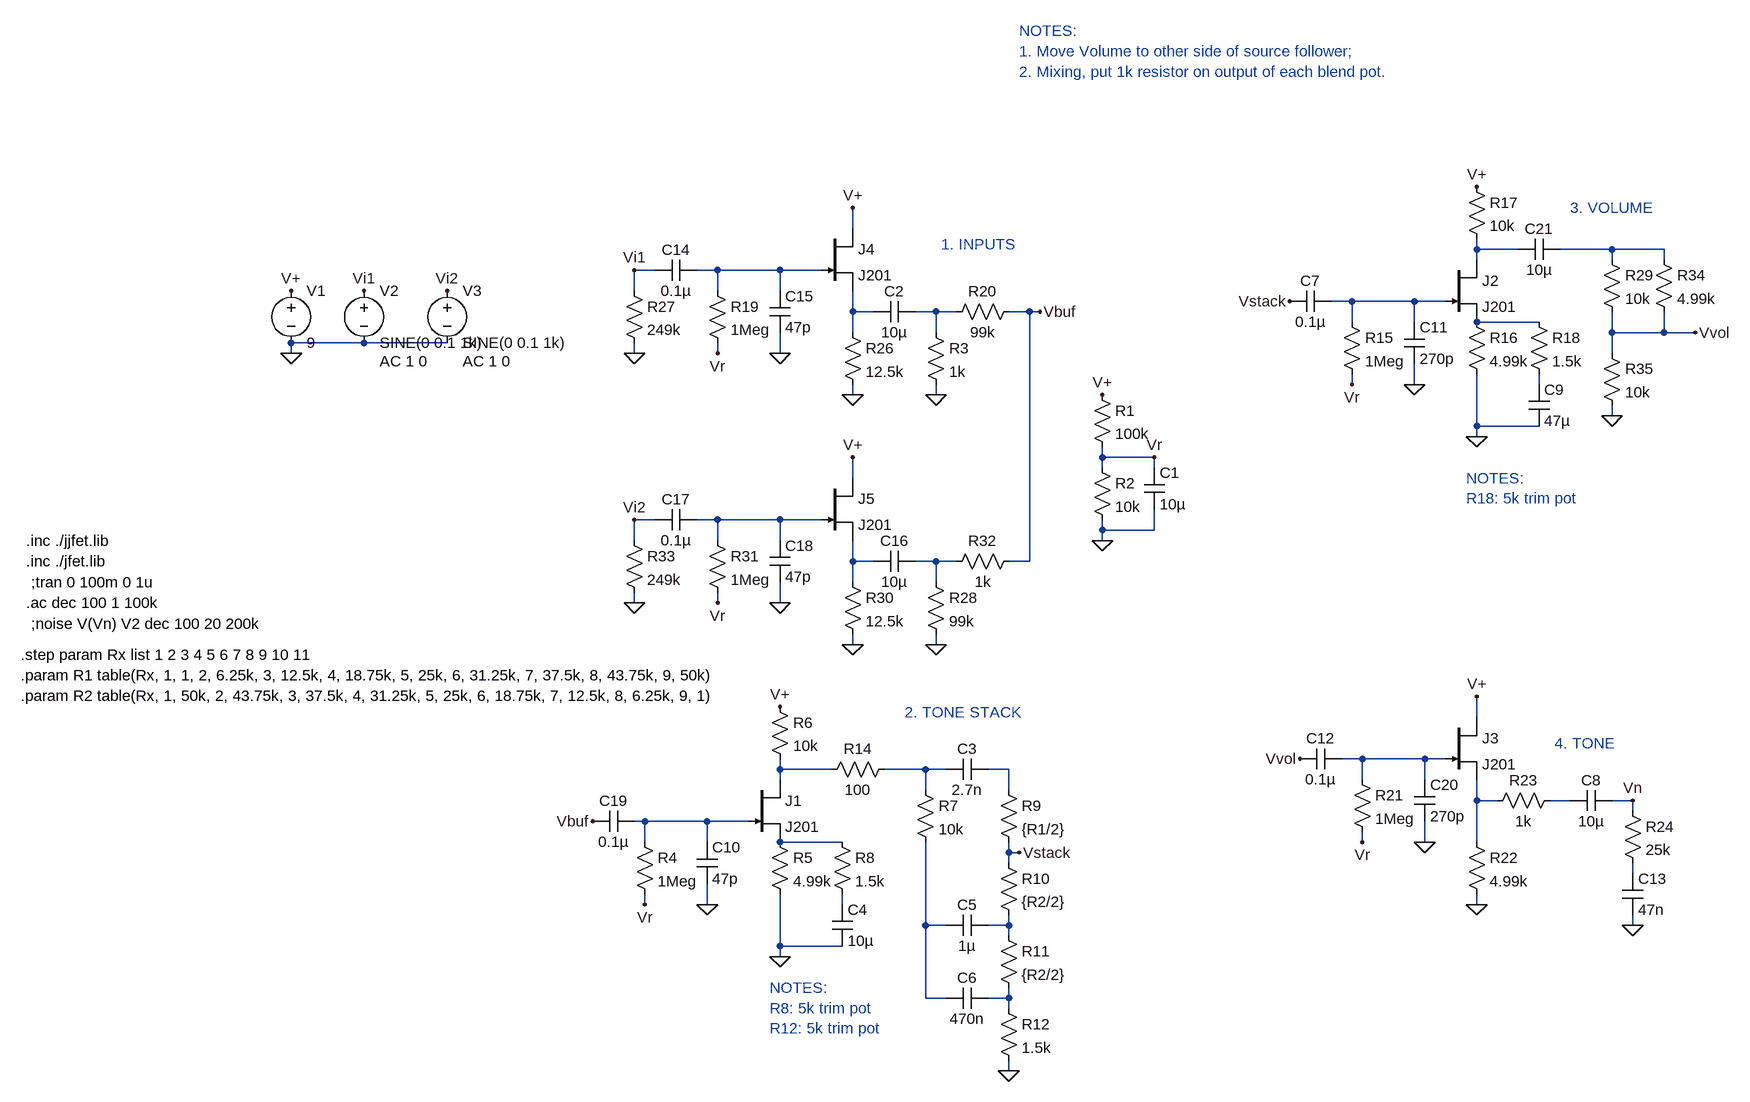
[diagram p0: schematic JFET_A.asc]
JFET_A.asc, the LTspice schematic file:
Version 4
SHEET 1 3108 1348
WIRE 960 32 960 0
WIRE 1920 64 1920 48
WIRE 1984 64 1920 64
WIRE 2128 64 2048 64
WIRE 2208 64 2128 64
WIRE 1920 80 1920 64
WIRE 2128 80 2128 64
WIRE 2208 80 2208 64
WIRE 656 96 624 96
WIRE 752 96 720 96
WIRE 848 96 752 96
WIRE 912 96 848 96
WIRE 624 128 624 96
WIRE 752 128 752 96
WIRE 848 128 848 96
WIRE 1728 144 1696 144
WIRE 1824 144 1728 144
WIRE 1872 144 1824 144
WIRE 960 160 960 128
WIRE 992 160 960 160
WIRE 1088 160 1056 160
WIRE 1120 160 1088 160
WIRE 1232 160 1200 160
WIRE 1248 160 1232 160
WIRE 1728 176 1728 144
WIRE 1824 176 1824 144
WIRE 2016 176 1920 176
WIRE 960 192 960 160
WIRE 1088 192 1088 160
WIRE 2128 192 2128 160
WIRE 2208 192 2208 160
WIRE 2208 192 2128 192
WIRE 2256 192 2208 192
WIRE 208 208 96 208
WIRE 336 208 208 208
WIRE 96 224 96 208
WIRE 624 224 624 208
WIRE 752 224 752 208
WIRE 848 224 848 192
WIRE 2128 224 2128 192
WIRE 1728 272 1728 256
WIRE 1824 272 1824 240
WIRE 2016 272 2016 256
WIRE 960 288 960 272
WIRE 1088 288 1088 272
WIRE 2128 320 2128 304
WIRE 1920 336 1920 256
WIRE 2016 336 1920 336
WIRE 1920 352 1920 336
WIRE 1344 384 1344 368
WIRE 1424 384 1344 384
WIRE 1344 400 1344 384
WIRE 1424 400 1424 384
WIRE 960 416 960 384
WIRE 656 480 624 480
WIRE 752 480 720 480
WIRE 848 480 752 480
WIRE 912 480 848 480
WIRE 1344 496 1344 480
WIRE 1424 496 1424 464
WIRE 1424 496 1344 496
WIRE 624 512 624 480
WIRE 752 512 752 480
WIRE 848 512 848 480
WIRE 1344 512 1344 496
WIRE 960 544 960 512
WIRE 992 544 960 544
WIRE 1088 544 1056 544
WIRE 1120 544 1088 544
WIRE 1232 544 1232 160
WIRE 1232 544 1200 544
WIRE 960 576 960 544
WIRE 1088 576 1088 544
WIRE 624 608 624 592
WIRE 752 608 752 592
WIRE 848 608 848 576
WIRE 960 672 960 656
WIRE 1088 672 1088 656
WIRE 1920 784 1920 752
WIRE 1744 848 1712 848
WIRE 1840 848 1744 848
WIRE 1872 848 1840 848
WIRE 848 864 848 848
WIRE 928 864 848 864
WIRE 1072 864 1008 864
WIRE 1104 864 1072 864
WIRE 1200 864 1168 864
WIRE 848 880 848 864
WIRE 1744 880 1744 848
WIRE 1840 880 1840 848
WIRE 1072 896 1072 864
WIRE 1200 896 1200 864
WIRE 1920 912 1920 880
WIRE 1952 912 1920 912
WIRE 2064 912 2032 912
WIRE 2160 912 2128 912
WIRE 2160 928 2160 912
WIRE 640 944 624 944
WIRE 736 944 640 944
WIRE 800 944 736 944
WIRE 640 976 640 944
WIRE 736 976 736 944
WIRE 944 976 848 976
WIRE 1744 976 1744 960
WIRE 1840 976 1840 944
WIRE 1920 976 1920 912
WIRE 1200 992 1200 976
WIRE 1216 992 1200 992
WIRE 1200 1008 1200 992
WIRE 2160 1024 2160 1008
WIRE 640 1072 640 1056
WIRE 736 1072 736 1040
WIRE 944 1072 944 1056
WIRE 1920 1072 1920 1056
WIRE 1072 1104 1072 976
WIRE 1104 1104 1072 1104
WIRE 1200 1104 1200 1088
WIRE 1200 1104 1168 1104
WIRE 2160 1104 2160 1088
WIRE 1200 1120 1200 1104
WIRE 848 1136 848 1056
WIRE 944 1136 848 1136
WIRE 848 1152 848 1136
WIRE 1072 1216 1072 1104
WIRE 1104 1216 1072 1216
WIRE 1200 1216 1200 1200
WIRE 1200 1216 1168 1216
WIRE 1200 1232 1200 1216
WIRE 1200 1328 1200 1312
FLAG 96 224 0
FLAG 96 128 V+
FLAG 208 128 Vi1
FLAG 1344 512 0
FLAG 1344 288 V+
FLAG 1424 384 Vr
FLAG 640 1072 Vr
FLAG 848 768 V+
FLAG 848 1152 0
FLAG 1200 1328 0
FLAG 1728 272 Vr
FLAG 1920 -32 V+
FLAG 1920 352 0
FLAG 1824 272 0
FLAG 336 128 Vi2
FLAG 1744 976 Vr
FLAG 1920 752 V+
FLAG 2160 1104 0
FLAG 960 0 V+
FLAG 752 224 Vr
FLAG 848 224 0
FLAG 960 288 0
FLAG 624 224 0
FLAG 624 96 Vi1
FLAG 960 384 V+
FLAG 752 608 Vr
FLAG 848 608 0
FLAG 960 672 0
FLAG 624 608 0
FLAG 624 480 Vi2
FLAG 1088 288 0
FLAG 1088 672 0
FLAG 736 1072 0
FLAG 1840 976 0
FLAG 1248 160 Vbuf
FLAG 560 944 Vbuf
FLAG 1216 992 Vstack
FLAG 1920 1072 0
FLAG 1632 144 Vstack
FLAG 2256 192 Vvol
FLAG 1648 848 Vvol
FLAG 2128 320 0
FLAG 2160 912 Vn
SYMBOL voltage 96 112 R0
SYMATTR InstName V1
SYMATTR Value 9
SYMBOL voltage 208 112 R0
WINDOW 123 24 124 Left 2
WINDOW 39 0 0 Left 2
SYMATTR Value2 AC 1 0
SYMATTR InstName V2
SYMATTR Value SINE(0 0.1 1k)
SYMBOL res 1328 272 R0
SYMATTR InstName R1
SYMATTR Value 100k
SYMBOL res 1328 384 R0
SYMATTR InstName R2
SYMATTR Value 10k
SYMBOL cap 1408 400 R0
SYMATTR InstName C1
SYMATTR Value 10µ
SYMBOL res 1072 176 R0
SYMATTR InstName R3
SYMATTR Value 1k
SYMBOL res 624 960 R0
SYMATTR InstName R4
SYMATTR Value 1Meg
SYMBOL cap 1056 144 R90
WINDOW 0 0 32 VBottom 2
WINDOW 3 32 32 VTop 2
SYMATTR InstName C2
SYMATTR Value 10µ
SYMBOL njf 800 880 R0
SYMATTR InstName J1
SYMATTR Value J201
SYMBOL res 832 960 R0
SYMATTR InstName R5
SYMATTR Value 4.99k
SYMBOL res 832 752 R0
SYMATTR InstName R6
SYMATTR Value 10k
SYMBOL cap 928 1072 R0
SYMATTR InstName C4
SYMATTR Value 10µ
SYMBOL res 928 960 R0
SYMATTR InstName R8
SYMATTR Value 1.5k
SYMBOL res 1056 880 R0
SYMATTR InstName R7
SYMATTR Value 10k
SYMBOL res 1184 880 R0
SYMATTR InstName R9
SYMATTR Value {R1/2}
SYMBOL res 1184 992 R0
SYMATTR InstName R10
SYMATTR Value {R2/2}
SYMBOL res 1184 1104 R0
SYMATTR InstName R11
SYMATTR Value {R2/2}
SYMBOL res 1184 1216 R0
SYMATTR InstName R12
SYMATTR Value 1.5k
SYMBOL cap 1168 848 R90
WINDOW 0 0 32 VBottom 2
WINDOW 3 32 32 VTop 2
SYMATTR InstName C3
SYMATTR Value 2.7n
SYMBOL cap 1168 1088 R90
WINDOW 0 0 32 VBottom 2
WINDOW 3 32 32 VTop 2
SYMATTR InstName C5
SYMATTR Value 1µ
SYMBOL cap 1168 1200 R90
WINDOW 0 0 32 VBottom 2
WINDOW 3 32 32 VTop 2
SYMATTR InstName C6
SYMATTR Value 470n
SYMBOL cap 1696 128 R90
WINDOW 0 0 32 VBottom 2
WINDOW 3 32 32 VTop 2
SYMATTR InstName C7
SYMATTR Value 0.1µ
SYMBOL res 1712 160 R0
SYMATTR InstName R15
SYMATTR Value 1Meg
SYMBOL njf 1872 80 R0
SYMATTR InstName J2
SYMATTR Value J201
SYMBOL res 1904 160 R0
SYMATTR InstName R16
SYMATTR Value 4.99k
SYMBOL res 1904 -48 R0
SYMATTR InstName R17
SYMATTR Value 10k
SYMBOL cap 2000 272 R0
SYMATTR InstName C9
SYMATTR Value 47µ
SYMBOL res 2000 160 R0
SYMATTR InstName R18
SYMATTR Value 1.5k
SYMBOL cap 2128 896 R90
WINDOW 0 0 32 VBottom 2
WINDOW 3 32 32 VTop 2
SYMATTR InstName C8
SYMATTR Value 10µ
SYMBOL cap 1808 176 R0
SYMATTR InstName C11
SYMATTR Value 270p
SYMBOL res 1024 848 R90
WINDOW 0 0 56 VBottom 2
WINDOW 3 32 56 VTop 2
SYMATTR InstName R14
SYMATTR Value 100
SYMBOL voltage 336 112 R0
WINDOW 123 24 124 Left 2
WINDOW 39 0 0 Left 2
SYMATTR Value2 AC 1 0
SYMATTR InstName V3
SYMATTR Value SINE(0 0.1 1k)
SYMBOL njf 1872 784 R0
SYMATTR InstName J3
SYMATTR Value J201
SYMBOL cap 1712 832 R90
WINDOW 0 0 32 VBottom 2
WINDOW 3 32 32 VTop 2
SYMATTR InstName C12
SYMATTR Value 0.1µ
SYMBOL res 1728 864 R0
SYMATTR InstName R21
SYMATTR Value 1Meg
SYMBOL res 1904 960 R0
SYMATTR InstName R22
SYMATTR Value 4.99k
SYMBOL res 2048 896 R90
WINDOW 0 0 56 VBottom 2
WINDOW 3 32 56 VTop 2
SYMATTR InstName R23
SYMATTR Value 1k
SYMBOL res 2144 912 R0
SYMATTR InstName R24
SYMATTR Value 25k
SYMBOL cap 2144 1024 R0
SYMATTR InstName C13
SYMATTR Value 47n
SYMBOL njf 912 32 R0
SYMATTR InstName J4
SYMATTR Value J201
SYMBOL res 944 176 R0
SYMATTR InstName R26
SYMATTR Value 12.5k
SYMBOL res 736 112 R0
SYMATTR InstName R19
SYMATTR Value 1Meg
SYMBOL cap 720 80 R90
WINDOW 0 0 32 VBottom 2
WINDOW 3 32 32 VTop 2
SYMATTR InstName C14
SYMATTR Value 0.1µ
SYMBOL cap 832 128 R0
SYMATTR InstName C15
SYMATTR Value 47p
SYMBOL res 1216 144 R90
WINDOW 0 0 56 VBottom 2
WINDOW 3 32 56 VTop 2
SYMATTR InstName R20
SYMATTR Value 99k
SYMBOL res 608 112 R0
SYMATTR InstName R27
SYMATTR Value 249k
SYMBOL res 1072 560 R0
SYMATTR InstName R28
SYMATTR Value 99k
SYMBOL cap 1056 528 R90
WINDOW 0 0 32 VBottom 2
WINDOW 3 32 32 VTop 2
SYMATTR InstName C16
SYMATTR Value 10µ
SYMBOL njf 912 416 R0
SYMATTR InstName J5
SYMATTR Value J201
SYMBOL res 944 560 R0
SYMATTR InstName R30
SYMATTR Value 12.5k
SYMBOL res 736 496 R0
SYMATTR InstName R31
SYMATTR Value 1Meg
SYMBOL cap 720 464 R90
WINDOW 0 0 32 VBottom 2
WINDOW 3 32 32 VTop 2
SYMATTR InstName C17
SYMATTR Value 0.1µ
SYMBOL cap 832 512 R0
SYMATTR InstName C18
SYMATTR Value 47p
SYMBOL res 1216 528 R90
WINDOW 0 0 56 VBottom 2
WINDOW 3 32 56 VTop 2
SYMATTR InstName R32
SYMATTR Value 1k
SYMBOL res 608 496 R0
SYMATTR InstName R33
SYMATTR Value 249k
SYMBOL cap 624 928 R90
WINDOW 0 0 32 VBottom 2
WINDOW 3 32 32 VTop 2
SYMATTR InstName C19
SYMATTR Value 0.1µ
SYMBOL cap 720 976 R0
SYMATTR InstName C10
SYMATTR Value 47p
SYMBOL cap 1824 880 R0
SYMATTR InstName C20
SYMATTR Value 270p
SYMBOL res 2112 64 R0
SYMATTR InstName R29
SYMATTR Value 10k
SYMBOL res 2192 64 R0
SYMATTR InstName R34
SYMATTR Value 4.99k
SYMBOL res 2112 208 R0
SYMATTR InstName R35
SYMATTR Value 10k
SYMBOL cap 2048 48 R90
WINDOW 0 0 32 VBottom 2
WINDOW 3 32 32 VTop 2
SYMATTR InstName C21
SYMATTR Value 10µ
TEXT -312 544 Left 2 !.inc ./jfet.lib
TEXT -304 576 Left 2 !;tran 0 100m 0 1u
TEXT -312 608 Left 2 !.ac dec 100 1 100k
TEXT -320 688 Left 2 !.step param Rx list 1 2 3 4 5 6 7 8 9 10 11\n.param R1 table(Rx, 1, 1, 2, 6.25k, 3, 12.5k, 4, 18.75k, 5, 25k, 6, 31.25k, 7, 37.5k, 8, 43.75k, 9, 50k)\n.param R2 table(Rx, 1, 50k, 2, 43.75k, 3, 37.5k, 4, 31.25k, 5, 25k, 6, 18.75k, 7, 12.5k, 8, 6.25k, 9, 1)
TEXT -312 512 Left 2 !.inc ./jjfet.lib
TEXT -304 640 Left 2 !;noise V(Vn) V2 dec 100 20 200k
TEXT 1216 -272 Left 2 ;NOTES:\n1. Move Volume to other side of source follower;\n2. Mixing, put 1k resistor on output of each blend pot.
TEXT 1904 416 Left 2 ;NOTES:\nR18: 5k trim pot
TEXT 832 1200 Left 2 ;NOTES:\nR8: 5k trim pot\nR12: 5k trim pot
TEXT 1096 56 Left 2 ;1. INPUTS
TEXT 1040 776 Left 2 ;2. TONE STACK
TEXT 2064 0 Left 2 ;3. VOLUME
TEXT 2040 824 Left 2 ;4. TONE

The netlist it stands for:
* JFET_A.asc
V1 V+ 0 9
V2 Vi1 0 SINE(0 0.1 1k) AC 1 0
R1 V+ Vr 100k
R2 Vr 0 10k
C1 Vr 0 10µ
R3 N006 0 1k
R4 N018 Vr 1Meg
C2 N006 N005 10µ
J1 N013 N018 N019 J201
R5 N019 0 4.99k
R6 V+ N013 10k
C4 N021 0 10µ
R8 N019 N021 1.5k
R7 N014 N022 10k
R9 N015 Vstack {R1/2}
R10 Vstack N023 {R2/2}
R11 N023 N024 {R2/2}
R12 N024 0 1.5k
C3 N015 N014 2.7n
C5 N023 N022 1µ
C6 N024 N022 470n
C7 N004 Vstack 0.1µ
R15 N004 Vr 1Meg
J2 N001 N004 N007 J201
R16 N007 0 4.99k
R17 V+ N001 10k
C9 N008 0 47µ
R18 N007 N008 1.5k
C8 Vn N017 10µ
C11 N004 0 270p
R14 N014 N013 100
V3 Vi2 0 SINE(0 0.1 1k) AC 1 0
J3 V+ N012 N016 J201
C12 N012 Vvol 0.1µ
R21 N012 Vr 1Meg
R22 N016 0 4.99k
R23 N017 N016 1k
R24 Vn N020 25k
C13 N020 0 47n
J4 V+ N003 N005 J201
R26 N005 0 12.5k
R19 N003 Vr 1Meg
C14 N003 Vi1 0.1µ
C15 N003 0 47p
R20 Vbuf N006 99k
R27 Vi1 0 249k
R28 N011 0 99k
C16 N011 N010 10µ
J5 V+ N009 N010 J201
R30 N010 0 12.5k
R31 N009 Vr 1Meg
C17 N009 Vi2 0.1µ
C18 N009 0 47p
R32 Vbuf N011 1k
R33 Vi2 0 249k
C19 N018 Vbuf 0.1µ
C10 N018 0 47p
C20 N012 0 270p
R29 N002 Vvol 10k
R34 N002 Vvol 4.99k
R35 Vvol 0 10k
C21 N002 N001 10µ
.model NJF NJF
.model PJF PJF
.lib standard.jft
.inc ./jfet.lib
;tran 0 100m 0 1u
.ac dec 100 1 100k
.step param Rx list 1 2 3 4 5 6 7 8 9 10 11
.param R1 table(Rx, 1, 1, 2, 6.25k, 3, 12.5k, 4, 18.75k, 5, 25k, 6, 31.25k, 7, 37.5k, 8, 43.75k, 9, 50k)
.param R2 table(Rx, 1, 50k, 2, 43.75k, 3, 37.5k, 4, 31.25k, 5, 25k, 6, 18.75k, 7, 12.5k, 8, 6.25k, 9, 1)
.inc ./jjfet.lib
;noise V(Vn) V2 dec 100 20 200k
* NOTES:
* 1. Move Volume to other side of source follower;
* 2. Mixing, put 1k resistor on output of each blend pot.
* NOTES:
* R18: 5k trim pot
* NOTES:
* R8: 5k trim pot
* R12: 5k trim pot
* 1. INPUTS
* 2. TONE STACK
* 3. VOLUME
* 4. TONE
.backanno
.end